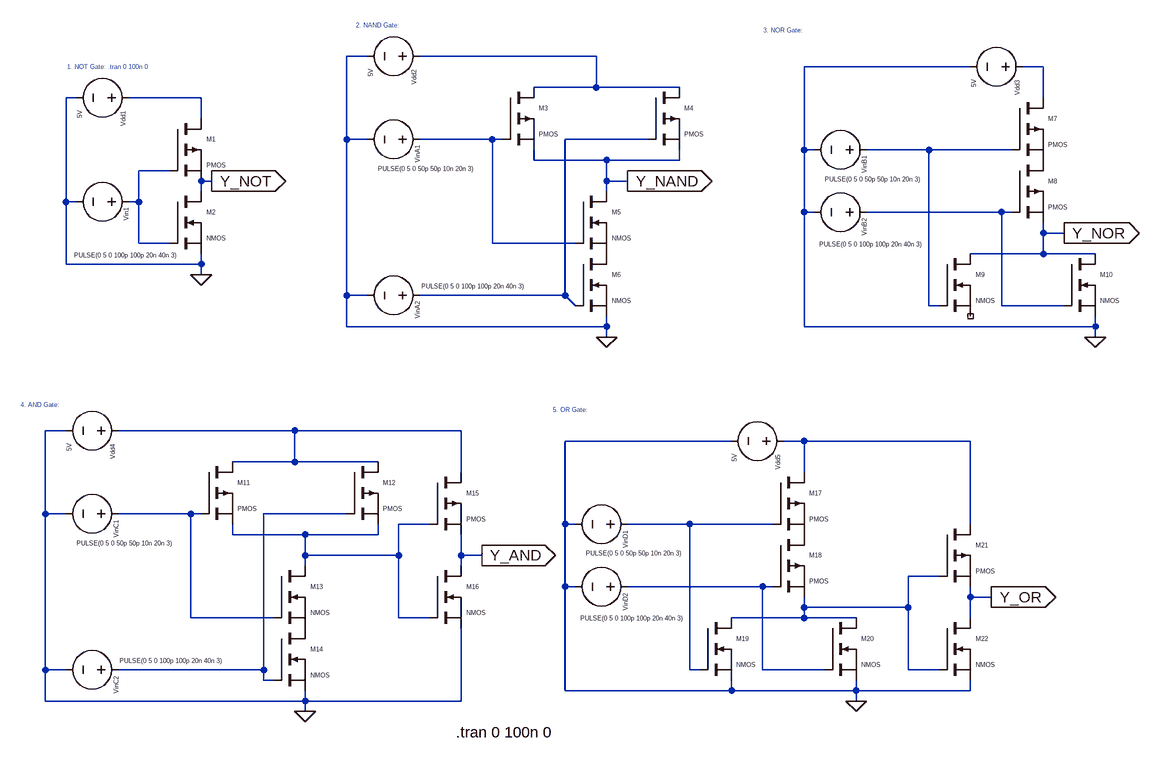
[diagram p0: schematic BasicGates_CMOS.asc]
BasicGates_CMOS.asc, the LTspice schematic file:
Version 4
SHEET 1 892 680
WIRE -400 -624 -432 -624
WIRE -48 -624 -320 -624
WIRE 528 -608 272 -608
WIRE 640 -608 608 -608
WIRE -48 -576 -48 -624
WIRE -48 -576 -144 -576
WIRE 80 -576 -48 -576
WIRE -848 -560 -864 -560
WIRE -656 -560 -768 -560
WIRE 640 -560 640 -608
WIRE -656 -528 -656 -560
WIRE -432 -496 -432 -624
WIRE -400 -496 -432 -496
WIRE -208 -496 -320 -496
WIRE -192 -496 -208 -496
WIRE 32 -496 -96 -496
WIRE 272 -480 272 -608
WIRE 288 -480 272 -480
WIRE 464 -480 368 -480
WIRE 592 -480 464 -480
WIRE -144 -464 -144 -480
WIRE -32 -464 -144 -464
WIRE 80 -464 80 -480
WIRE 80 -464 -32 -464
WIRE -704 -448 -752 -448
WIRE -640 -432 -656 -432
WIRE -32 -432 -32 -464
WIRE 0 -432 -32 -432
WIRE -656 -416 -656 -432
WIRE -32 -416 -32 -432
WIRE -864 -400 -864 -560
WIRE -848 -400 -864 -400
WIRE -752 -400 -752 -448
WIRE -752 -400 -768 -400
WIRE 272 -384 272 -480
WIRE 288 -384 272 -384
WIRE 576 -384 368 -384
WIRE 592 -384 576 -384
WIRE 640 -352 640 -368
WIRE 672 -352 640 -352
WIRE -752 -336 -752 -400
WIRE -704 -336 -752 -336
WIRE -208 -336 -208 -496
WIRE -80 -336 -208 -336
WIRE 640 -320 640 -352
WIRE 640 -320 528 -320
WIRE 720 -320 640 -320
WIRE -864 -304 -864 -400
WIRE -656 -304 -656 -320
WIRE -656 -304 -864 -304
WIRE -656 -288 -656 -304
WIRE -432 -256 -432 -496
WIRE -400 -256 -432 -256
WIRE -96 -256 -96 -496
WIRE -96 -256 -320 -256
WIRE -80 -240 -96 -256
WIRE 464 -240 464 -480
WIRE 480 -240 464 -240
WIRE 576 -240 576 -384
WIRE 672 -240 576 -240
WIRE -432 -208 -432 -256
WIRE -32 -208 -32 -224
WIRE -32 -208 -432 -208
WIRE 272 -208 272 -384
WIRE 720 -208 720 -224
WIRE 720 -208 272 -208
WIRE -32 -192 -32 -208
WIRE 720 -192 720 -208
WIRE -864 -48 -896 -48
WIRE -512 -48 -784 -48
WIRE -256 -48 -512 -48
WIRE 160 -32 -96 -32
WIRE 272 -32 240 -32
WIRE 528 -32 272 -32
WIRE -512 0 -512 -48
WIRE -512 0 -608 0
WIRE -384 0 -512 0
WIRE -256 16 -256 -48
WIRE 272 16 272 -32
WIRE -896 80 -896 -48
WIRE -864 80 -896 80
WIRE -672 80 -784 80
WIRE -656 80 -672 80
WIRE -432 80 -560 80
WIRE -304 96 -352 96
WIRE -96 96 -96 -32
WIRE -80 96 -96 96
WIRE 96 96 0 96
WIRE 224 96 96 96
WIRE 528 96 528 -32
WIRE -608 112 -608 96
WIRE -496 112 -608 112
WIRE -384 112 -384 96
WIRE -384 112 -496 112
WIRE -496 144 -496 112
WIRE -352 144 -352 96
WIRE -352 144 -496 144
WIRE -256 144 -256 112
WIRE -224 144 -256 144
WIRE -496 160 -496 144
WIRE -256 160 -256 144
WIRE 480 176 432 176
WIRE -96 192 -96 96
WIRE -80 192 -96 192
WIRE 208 192 0 192
WIRE 224 192 208 192
WIRE 528 208 528 192
WIRE 560 208 528 208
WIRE 272 224 272 208
WIRE 432 224 432 176
WIRE 432 224 272 224
WIRE -672 240 -672 80
WIRE -544 240 -672 240
WIRE -352 240 -352 144
WIRE -304 240 -352 240
WIRE 272 240 272 224
WIRE 272 240 160 240
WIRE 352 240 272 240
WIRE 528 240 528 208
WIRE -896 320 -896 80
WIRE -864 320 -896 320
WIRE -560 320 -560 80
WIRE -560 320 -784 320
WIRE 96 320 96 96
WIRE 112 320 96 320
WIRE 208 320 208 192
WIRE 304 320 208 320
WIRE 432 320 432 224
WIRE 480 320 432 320
WIRE -560 336 -560 320
WIRE -544 336 -560 336
WIRE -96 352 -96 192
WIRE 160 352 160 336
WIRE 160 352 -96 352
WIRE 352 352 352 336
WIRE 352 352 160 352
WIRE 528 352 528 336
WIRE 528 352 352 352
WIRE -896 368 -896 320
WIRE -496 368 -496 352
WIRE -496 368 -896 368
WIRE -256 368 -256 256
WIRE -256 368 -496 368
WIRE 352 368 352 352
WIRE -496 384 -496 368
FLAG -656 -288 0
FLAG -32 -192 0
FLAG 720 -192 0
FLAG -496 384 0
FLAG 352 368 0
FLAG 0 -432 Y_NAND
IOPIN 0 -432 Out
FLAG 672 -352 Y_NOR
IOPIN 672 -352 Out
FLAG -640 -432 Y_NOT
IOPIN -640 -432 Out
FLAG -224 144 Y_AND
IOPIN -224 144 Out
FLAG 560 208 Y_OR
IOPIN 560 208 Out
SYMBOL pmos -704 -528 R0
WINDOW 0 56 32 Left 0
WINDOW 3 56 72 Left 0
SYMATTR InstName M1
SYMBOL nmos -704 -416 R0
WINDOW 0 56 32 Left 0
WINDOW 3 56 72 Left 0
SYMATTR InstName M2
SYMBOL voltage -752 -560 R90
WINDOW 0 21 24 Left 0
WINDOW 3 20 91 Left 0
WINDOW 123 0 0 Left 0
WINDOW 39 0 0 Left 0
SYMATTR InstName Vdd1
SYMATTR Value 5V
SYMBOL voltage -752 -400 R90
WINDOW 0 10 19 Left 0
WINDOW 3 82 -61 VRight 0
WINDOW 123 0 0 Left 0
WINDOW 39 0 0 Left 0
SYMATTR InstName Vin1
SYMATTR Value PULSE(0 5 0 100p 100p 20n 40n 3)
SYMBOL voltage -304 -624 R90
WINDOW 0 21 24 Left 0
WINDOW 3 20 91 Left 0
WINDOW 123 0 0 Left 0
WINDOW 39 0 0 Left 0
SYMATTR InstName Vdd2
SYMATTR Value 5V
SYMBOL pmos -192 -576 R0
WINDOW 0 56 32 Left 0
WINDOW 3 56 72 Left 0
SYMATTR InstName M3
SYMBOL pmos 32 -576 R0
WINDOW 0 56 32 Left 0
WINDOW 3 56 72 Left 0
SYMATTR InstName M4
SYMBOL nmos -80 -416 R0
WINDOW 0 56 32 Left 0
WINDOW 3 56 72 Left 0
SYMATTR InstName M5
SYMBOL nmos -80 -320 R0
WINDOW 0 56 32 Left 0
WINDOW 3 56 72 Left 0
SYMATTR InstName M6
SYMBOL voltage -304 -496 R90
WINDOW 0 10 19 Left 0
WINDOW 3 45 -69 VRight 0
WINDOW 123 0 0 Left 0
WINDOW 39 0 0 Left 0
SYMATTR InstName VinA1
SYMATTR Value PULSE(0 5 0 50p 50p 10n 20n 3)
SYMBOL voltage -304 -256 R90
WINDOW 0 10 19 Left 0
WINDOW 3 -14 -147 VRight 0
WINDOW 123 0 0 Left 0
WINDOW 39 0 0 Left 0
SYMATTR InstName VinA2
SYMATTR Value PULSE(0 5 0 100p 100p 20n 40n 3)
SYMBOL voltage 624 -608 R90
WINDOW 0 21 24 Left 0
WINDOW 3 20 91 Left 0
WINDOW 123 0 0 Left 0
WINDOW 39 0 0 Left 0
SYMATTR InstName Vdd3
SYMATTR Value 5V
SYMBOL pmos 592 -560 R0
WINDOW 0 56 32 Left 0
WINDOW 3 56 72 Left 0
SYMATTR InstName M7
SYMBOL pmos 592 -464 R0
WINDOW 0 56 32 Left 0
WINDOW 3 56 72 Left 0
SYMATTR InstName M8
SYMBOL nmos 480 -320 R0
WINDOW 0 56 32 Left 0
WINDOW 3 56 72 Left 0
SYMATTR InstName M9
SYMBOL nmos 672 -320 R0
WINDOW 0 56 32 Left 0
WINDOW 3 56 72 Left 0
SYMATTR InstName M10
SYMBOL voltage 384 -480 R90
WINDOW 0 10 19 Left 0
WINDOW 3 45 -69 VRight 0
WINDOW 123 0 0 Left 0
WINDOW 39 0 0 Left 0
SYMATTR InstName VinB1
SYMATTR Value PULSE(0 5 0 50p 50p 10n 20n 3)
SYMBOL voltage 384 -384 R90
WINDOW 0 10 19 Left 0
WINDOW 3 49 -72 VRight 0
WINDOW 123 0 0 Left 0
WINDOW 39 0 0 Left 0
SYMATTR InstName VinB2
SYMATTR Value PULSE(0 5 0 100p 100p 20n 40n 3)
SYMBOL voltage -768 -48 R90
WINDOW 0 21 24 Left 0
WINDOW 3 20 91 Left 0
WINDOW 123 0 0 Left 0
WINDOW 39 0 0 Left 0
SYMATTR InstName Vdd4
SYMATTR Value 5V
SYMBOL pmos -656 0 R0
WINDOW 0 56 32 Left 0
WINDOW 3 56 72 Left 0
SYMATTR InstName M11
SYMBOL pmos -432 0 R0
WINDOW 0 56 32 Left 0
WINDOW 3 56 72 Left 0
SYMATTR InstName M12
SYMBOL nmos -544 160 R0
WINDOW 0 56 32 Left 0
WINDOW 3 56 72 Left 0
SYMATTR InstName M13
SYMBOL nmos -544 256 R0
WINDOW 0 56 32 Left 0
WINDOW 3 56 72 Left 0
SYMATTR InstName M14
SYMBOL voltage -768 80 R90
WINDOW 0 10 19 Left 0
WINDOW 3 45 -69 VRight 0
WINDOW 123 0 0 Left 0
WINDOW 39 0 0 Left 0
SYMATTR InstName VinC1
SYMATTR Value PULSE(0 5 0 50p 50p 10n 20n 3)
SYMBOL voltage -768 320 R90
WINDOW 0 10 19 Left 0
WINDOW 3 -14 -147 VRight 0
WINDOW 123 0 0 Left 0
WINDOW 39 0 0 Left 0
SYMATTR InstName VinC2
SYMATTR Value PULSE(0 5 0 100p 100p 20n 40n 3)
SYMBOL pmos -304 16 R0
WINDOW 0 56 32 Left 0
WINDOW 3 56 72 Left 0
SYMATTR InstName M15
SYMBOL nmos -304 160 R0
WINDOW 0 56 32 Left 0
WINDOW 3 56 72 Left 0
SYMATTR InstName M16
SYMBOL voltage 256 -32 R90
WINDOW 0 21 24 Left 0
WINDOW 3 20 91 Left 0
WINDOW 123 0 0 Left 0
WINDOW 39 0 0 Left 0
SYMATTR InstName Vdd5
SYMATTR Value 5V
SYMBOL pmos 224 16 R0
WINDOW 0 56 32 Left 0
WINDOW 3 56 72 Left 0
SYMATTR InstName M17
SYMBOL pmos 224 112 R0
WINDOW 0 56 32 Left 0
WINDOW 3 56 72 Left 0
SYMATTR InstName M18
SYMBOL nmos 112 240 R0
WINDOW 0 56 32 Left 0
WINDOW 3 56 72 Left 0
SYMATTR InstName M19
SYMBOL nmos 304 240 R0
WINDOW 0 56 32 Left 0
WINDOW 3 56 72 Left 0
SYMATTR InstName M20
SYMBOL voltage 16 96 R90
WINDOW 0 10 19 Left 0
WINDOW 3 45 -69 VRight 0
WINDOW 123 0 0 Left 0
WINDOW 39 0 0 Left 0
SYMATTR InstName VinD1
SYMATTR Value PULSE(0 5 0 50p 50p 10n 20n 3)
SYMBOL voltage 16 192 R90
WINDOW 0 10 19 Left 0
WINDOW 3 49 -72 VRight 0
WINDOW 123 0 0 Left 0
WINDOW 39 0 0 Left 0
SYMATTR InstName VinD2
SYMATTR Value PULSE(0 5 0 100p 100p 20n 40n 3)
SYMBOL pmos 480 96 R0
WINDOW 0 56 32 Left 0
WINDOW 3 56 72 Left 0
SYMATTR InstName M21
SYMBOL nmos 480 240 R0
WINDOW 0 56 32 Left 0
WINDOW 3 56 72 Left 0
SYMATTR InstName M22
TEXT -800 -608 Center 0 ;1. NOT Gate: .tran 0 100n 0
TEXT -264 416 Left 2 !.tran 0 100n 0
TEXT -384 -672 Center 0 ;2. NAND Gate:
TEXT 240 -664 Center 0 ;3. NOR Gate:
TEXT -904 -88 Center 0 ;4. AND Gate:
TEXT -88 -80 Center 0 ;5. OR Gate:

The netlist it stands for:
* BasicGates_CMOS.asc
M1 N003 N007 Y_NOT Y_NOT PMOS
M2 Y_NOT N007 0 0 NMOS
Vdd1 N003 0 5V
Vin1 N007 0 PULSE(0 5 0 100p 100p 20n 40n 3)
Vdd2 N001 0 5V
M3 N001 N004 Y_NAND Y_NAND PMOS
M4 N001 N005 Y_NAND Y_NAND PMOS
M5 Y_NAND N004 P001 P001 NMOS
M6 P001 N005 0 0 NMOS
VinA1 N004 0 PULSE(0 5 0 50p 50p 10n 20n 3)
VinA2 N005 0 PULSE(0 5 0 100p 100p 20n 40n 3)
Vdd3 N002 0 5V
M7 N002 N006 P002 P002 PMOS
M8 P002 N008 Y_NOR Y_NOR PMOS
M9 Y_NOR N006 NC_01 NC_01 NMOS
M10 Y_NOR N008 0 0 NMOS
VinB1 N006 0 PULSE(0 5 0 50p 50p 10n 20n 3)
VinB2 N008 0 PULSE(0 5 0 100p 100p 20n 40n 3)
Vdd4 N009 0 5V
M11 N009 N011 N013 N013 PMOS
M12 N009 N012 N013 N013 PMOS
M13 N013 N011 P003 P003 NMOS
M14 P003 N012 0 0 NMOS
VinC1 N011 0 PULSE(0 5 0 50p 50p 10n 20n 3)
VinC2 N012 0 PULSE(0 5 0 100p 100p 20n 40n 3)
M15 N009 N013 Y_AND Y_AND PMOS
M16 Y_AND N013 0 0 NMOS
Vdd5 N010 0 5V
M17 N010 N014 P004 P004 PMOS
M18 P004 N016 N015 N015 PMOS
M19 N015 N014 0 0 NMOS
M20 N015 N016 0 0 NMOS
VinD1 N014 0 PULSE(0 5 0 50p 50p 10n 20n 3)
VinD2 N016 0 PULSE(0 5 0 100p 100p 20n 40n 3)
M21 N010 N015 Y_OR Y_OR PMOS
M22 Y_OR N015 0 0 NMOS
.model NMOS NMOS
.model PMOS PMOS
.lib standard.mos
* 1. NOT Gate: .tran 0 100n 0
.tran 0 100n 0
* 2. NAND Gate:
* 3. NOR Gate:
* 4. AND Gate:
* 5. OR Gate:
.backanno
.end